# Altium schematic sheet relay.SchDoc
size A3; SheetNumber: 3; SheetTotal: 7
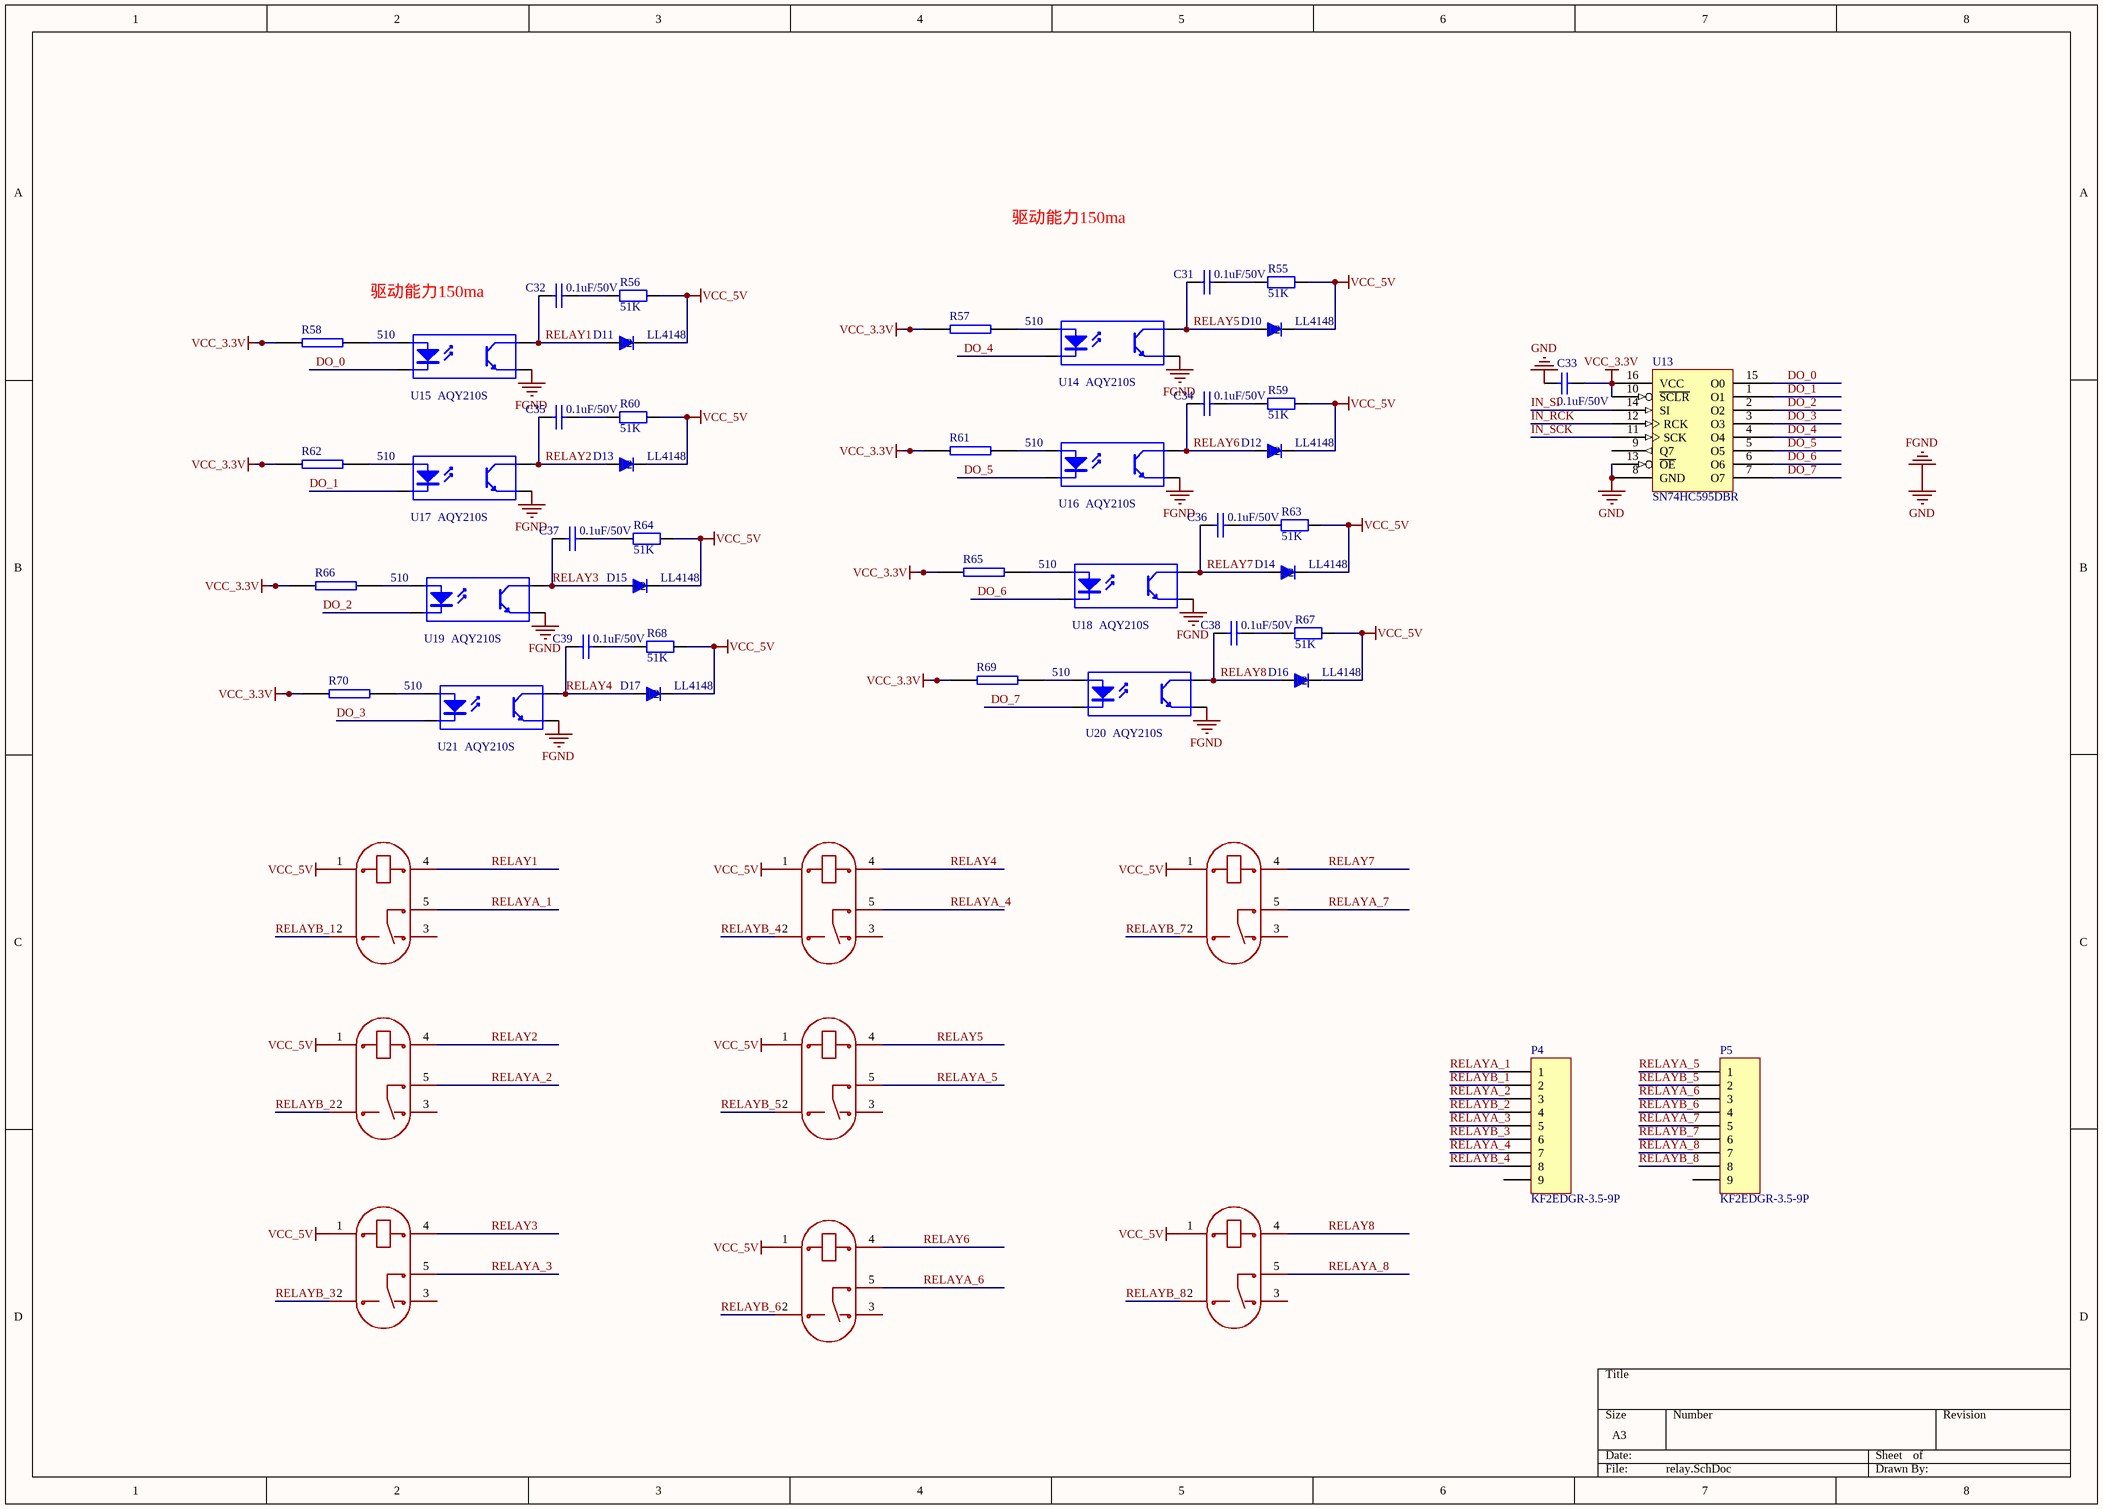
[diagram p0: relay.SchDoc]

## Parts
C31  0.1uF/50V  [0603C]
C32  0.1uF/50V  [0603C]
C33  0.1uF/50V  [0603C]
C34  0.1uF/50V  [0603C]
C35  0.1uF/50V  [0603C]
C36  0.1uF/50V  [0603C]
C37  0.1uF/50V  [0603C]
C38  0.1uF/50V  [0603C]
C39  0.1uF/50V  [0603C]
D10  LL4148  [DO-213AB/LL34/MiniMELF]
D11  LL4148  [DO-213AB/LL34/MiniMELF]
D12  LL4148  [DO-213AB/LL34/MiniMELF]
D13  LL4148  [DO-213AB/LL34/MiniMELF]
D14  LL4148  [DO-213AB/LL34/MiniMELF]
D15  LL4148  [DO-213AB/LL34/MiniMELF]
D16  LL4148  [DO-213AB/LL34/MiniMELF]
D17  LL4148  [DO-213AB/LL34/MiniMELF]
P4  KF2EDGR-3.5-9P  [CONN-TH_9P-P3.50_KF2EDGR-3.5-9P]
P5  KF2EDGR-3.5-9P  [CONN-TH_9P-P3.50_KF2EDGR-3.5-9P]
R55  51K  [0603R]
R56  51K  [0603R]
R57  510  [0603R]
R58  510  [0603R]
R59  51K  [0603R]
R60  51K  [0603R]
R61  510  [0603R]
R62  510  [0603R]
R63  51K  [0603R]
R64  51K  [0603R]
R65  510  [0603R]
R66  510  [0603R]
R67  51K  [0603R]
R68  51K  [0603R]
R69  510  [0603R]
R70  510  [0603R]
RLY1  SRD-05VDC-SL-C  [RELAY-TH_SRD-XXVDC-XL-C]  (value not drawn)
RLY2  SRD-05VDC-SL-C  [RELAY-TH_SRD-XXVDC-XL-C]  (value not drawn)
RLY3  SRD-05VDC-SL-C  [RELAY-TH_SRD-XXVDC-XL-C]  (value not drawn)
RLY4  SRD-05VDC-SL-C  [RELAY-TH_SRD-XXVDC-XL-C]  (value not drawn)
RLY5  SRD-05VDC-SL-C  [RELAY-TH_SRD-XXVDC-XL-C]  (value not drawn)
RLY6  SRD-05VDC-SL-C  [RELAY-TH_SRD-XXVDC-XL-C]  (value not drawn)
RLY7  SRD-05VDC-SL-C  [RELAY-TH_SRD-XXVDC-XL-C]  (value not drawn)
RLY8  SRD-05VDC-SL-C  [RELAY-TH_SRD-XXVDC-XL-C]  (value not drawn)
U13  SN74HC595DBR  [SSOP16]
U14  AQY210S  [sop4]
U15  AQY210S  [sop4]
U16  AQY210S  [sop4]
U17  AQY210S  [sop4]
U18  AQY210S  [sop4]
U19  AQY210S  [sop4]
U20  AQY210S  [sop4]
U21  AQY210S  [sop4]

## Nets
FGND: C33.2 U13.8(GND) U13.13(~{OE}) U14.3(E) U15.3(E) U16.3(E) U17.3(E) U18.3(E) U19.3(E) U20.3(E) U21.3(E)  [also labelled GND]
VCC_3.3V: C33.1 R57.2 R58.2 R61.2 R62.2 R65.2 R66.2 R69.2 R70.2 U13.10(~{SCLR}) U13.16(VCC)
VCC_5V: D10.2(1) D11.2(1) D12.2(1) D13.2(1) D14.2(1) D15.2(1) D16.2(1) D17.2(1) R55.2 R56.2 R59.2 R60.2 R63.2 R64.2 R67.2 R68.2 RLY1.1 RLY2.1 RLY3.1 RLY4.1 RLY5.1 RLY6.1 RLY7.1 RLY8.1
DO_0: U13.15(O0) U15.2(K)
DO_1: U13.1(O1) U17.2(K)
DO_2: U13.2(O2) U19.2(K)
DO_3: U13.3(O3) U21.2(K)
DO_4: U13.4(O4) U14.2(K)
DO_5: U13.5(O5) U16.2(K)
DO_6: U13.6(O6) U18.2(K)
DO_7: U13.7(O7) U20.2(K)
IN_RCK: U13.12(RCK)
IN_SCK: U13.11(SCK)
IN_SI: U13.14(SI)
RELAY1: C32.1 D11.1(2) RLY1.4 U15.4(C)
RELAY2: C35.1 D13.1(2) RLY4.4 U17.4(C)
RELAY3: C37.1 D15.1(2) RLY6.4 U19.4(C)
RELAY4: C39.1 D17.1(2) RLY2.4 U21.4(C)
RELAY5: C31.1 D10.1(2) RLY5.4 U14.4(C)
RELAY6: C34.1 D12.1(2) RLY8.4 U16.4(C)
RELAY7: C36.1 D14.1(2) RLY3.4 U18.4(C)
RELAY8: C38.1 D16.1(2) RLY7.4 U20.4(C)
RELAYA_1: P4.1 RLY1.5
RELAYA_2: P4.3 RLY4.5
RELAYA_3: P4.5 RLY6.5
RELAYA_4: P4.7 RLY2.5
RELAYA_5: P5.1 RLY5.5
RELAYA_6: P5.3 RLY8.5
RELAYA_7: P5.5 RLY3.5
RELAYA_8: P5.7 RLY7.5
RELAYB_1: P4.2 RLY1.2
RELAYB_2: P4.4 RLY4.2
RELAYB_3: P4.6 RLY6.2
RELAYB_4: P4.8 RLY2.2
RELAYB_5: P5.2 RLY5.2
RELAYB_6: P5.4 RLY8.2
RELAYB_7: P5.6 RLY3.2
RELAYB_8: P5.8 RLY7.2
NetC31_2: C31.2 R55.1
NetC32_2: C32.2 R56.1
NetC34_2: C34.2 R59.1
NetC35_2: C35.2 R60.1
NetC36_2: C36.2 R63.1
NetC37_2: C37.2 R64.1
NetC38_2: C38.2 R67.1
NetC39_2: C39.2 R68.1
NetR57_1: R57.1 U14.1(A)
NetR58_1: R58.1 U15.1(A)
NetR61_1: R61.1 U16.1(A)
NetR62_1: R62.1 U17.1(A)
NetR65_1: R65.1 U18.1(A)
NetR66_1: R66.1 U19.1(A)
NetR69_1: R69.1 U20.1(A)
NetR70_1: R70.1 U21.1(A)

Not connected (* = marked no-connect by the designer): P4 9; P5 9; RLY1 3; RLY2 3; RLY3 3; RLY4 3; RLY5 3; RLY6 3; RLY7 3; RLY8 3; U13 9(Q7)

## Notes on the sheet
- 驱动能力150ma

## Library data of the parts
C31 C32 C34-C39 = CAP: Capacitor
C33 = Cap: Capacitor; Value: 0.1uF
D10-D17 = LL4148: VISHAY,LL4148,圆柱体MiniMELF100V/2A,ROHS; 版本: V1.00; 名称: 快速开关二极管; 物料编号: APLLY; 制造商: VISHAY
P4 P5 = Header 9: Header, 9-Pin
R55 R56 R59 R60 R63 R64 R67 R68 = Res0805M
R57 R58 R61 R62 R65 R66 R69 R70 = RES2
U13 = 74HC595
U14-U21 = Optoisolator1: 4-Pin Phototransistor Optocoupler